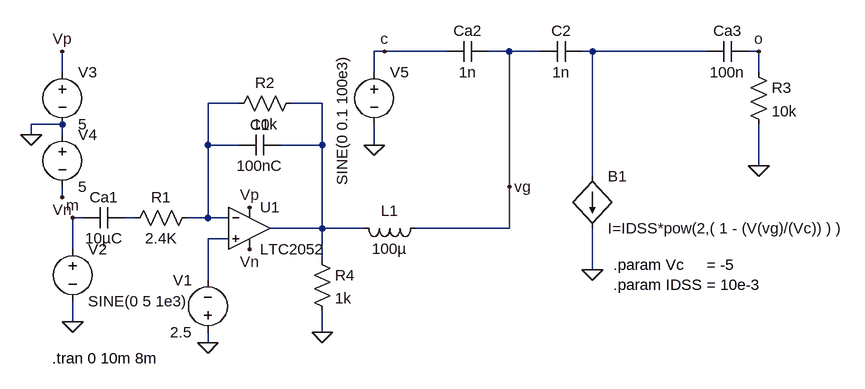
[diagram p0: schematic modFM.asc]
modFM.asc, the LTspice schematic file:
Version 4
SHEET 1 1244 680
WIRE 336 -32 320 -32
WIRE 432 -32 336 -32
WIRE 528 -32 496 -32
WIRE 576 -32 528 -32
WIRE 656 -32 640 -32
WIRE 832 -32 656 -32
WIRE 912 -32 896 -32
WIRE -160 0 -160 -32
WIRE 320 0 320 -32
WIRE 912 0 912 -32
WIRE 112 48 64 48
WIRE 240 48 192 48
WIRE -160 80 -208 80
WIRE -208 96 -208 80
WIRE -160 96 -160 80
WIRE 64 112 64 48
WIRE 112 112 64 112
WIRE 240 112 240 48
WIRE 240 112 176 112
WIRE 320 112 320 80
WIRE 912 144 912 80
WIRE 656 160 656 -32
WIRE 528 176 528 -32
WIRE -160 192 -160 176
WIRE -128 224 -144 224
WIRE -48 224 -64 224
WIRE 64 224 64 112
WIRE 64 224 32 224
WIRE 96 224 64 224
WIRE 240 240 240 112
WIRE 240 240 160 240
WIRE 304 240 240 240
WIRE 528 240 528 176
WIRE 528 240 384 240
WIRE 96 256 64 256
WIRE -144 272 -144 224
WIRE 240 288 240 240
WIRE 656 304 656 240
WIRE 64 320 64 256
WIRE -144 384 -144 352
WIRE 240 400 240 368
WIRE 64 416 64 400
FLAG 64 416 0
FLAG -144 384 0
FLAG -208 96 0
FLAG -160 -32 Vp
FLAG 128 208 Vp
FLAG -160 192 Vn
FLAG 128 272 Vn
FLAG 320 112 0
FLAG 656 304 0
FLAG 528 176 vg
FLAG 912 144 0
FLAG 240 400 0
FLAG 336 -32 c
FLAG -144 224 m
FLAG 912 -32 o
SYMBOL res 48 208 R90
WINDOW 0 0 56 VBottom 2
WINDOW 3 32 56 VTop 2
SYMATTR InstName R1
SYMATTR Value 2.4K
SYMBOL res 208 32 R90
WINDOW 0 0 56 VBottom 2
WINDOW 3 32 56 VTop 2
SYMATTR InstName R2
SYMATTR Value 10k
SYMBOL cap 176 96 R90
WINDOW 0 0 32 VBottom 2
WINDOW 3 32 32 VTop 2
SYMATTR InstName C1
SYMATTR Value 100nC
SYMBOL cap -64 208 R90
WINDOW 0 0 32 VBottom 2
WINDOW 3 32 32 VTop 2
SYMATTR InstName Ca1
SYMATTR Value 10µC
SYMBOL voltage 64 416 R180
WINDOW 0 24 96 Left 2
WINDOW 3 24 16 Left 2
WINDOW 123 0 0 Left 2
WINDOW 39 0 0 Left 2
SYMATTR InstName V1
SYMATTR Value 2.5
SYMBOL voltage -144 256 R0
WINDOW 123 0 0 Left 2
WINDOW 39 0 0 Left 2
SYMATTR InstName V2
SYMATTR Value SINE(0 5 1e3)
SYMBOL Opamps\\LTC2052 128 240 R0
SYMATTR InstName U1
SYMBOL voltage -160 -16 R0
WINDOW 123 0 0 Left 2
WINDOW 39 0 0 Left 2
SYMATTR InstName V3
SYMATTR Value 5
SYMBOL voltage -160 80 R0
WINDOW 123 0 0 Left 2
WINDOW 39 0 0 Left 2
SYMATTR InstName V4
SYMATTR Value 5
SYMBOL ind 400 224 R90
WINDOW 0 5 56 VBottom 2
WINDOW 3 32 56 VTop 2
SYMATTR InstName L1
SYMATTR Value 100µ
SYMBOL voltage 320 -16 R0
WINDOW 123 0 0 Left 2
WINDOW 39 0 0 Left 2
WINDOW 3 -49 190 VLeft 2
SYMATTR InstName V5
SYMATTR Value SINE(0 0.1 100e3)
SYMBOL cap 496 -48 R90
WINDOW 0 0 32 VBottom 2
WINDOW 3 32 32 VTop 2
SYMATTR InstName Ca2
SYMATTR Value 1n
SYMBOL cap 640 -48 R90
WINDOW 0 0 32 VBottom 2
WINDOW 3 32 32 VTop 2
SYMATTR InstName C2
SYMATTR Value 1n
SYMBOL bi 656 160 R0
SYMATTR InstName B1
SYMATTR Value I=IDSS*pow(2,( 1 - (V(vg)/(Vc)) ) )
SYMBOL res 896 -16 R0
SYMATTR InstName R3
SYMATTR Value 10k
SYMBOL cap 896 -48 R90
WINDOW 0 0 32 VBottom 2
WINDOW 3 32 32 VTop 2
SYMATTR InstName Ca3
SYMATTR Value 100n
SYMBOL res 224 272 R0
SYMATTR InstName R4
SYMATTR Value 1k
TEXT -176 440 Left 2 !.tran 0 10m 8m
TEXT 688 296 Left 2 !.param Vc     = -5\n.param IDSS = 10e-3

The netlist it stands for:
* modFM.asc
R1 N002 N004 2.4K
R2 N003 N002 10k
C1 N003 N002 100nC
Ca1 N004 m 10µC
V1 0 N005 2.5
V2 m 0 SINE(0 5 1e3)
* U1: LTC2052 (symbol Opamps\LTC2052 not available, pins judged from their places): In+=N005 In-=N002 V+=Vp V-=Vn OUT=N003
V3 Vp 0 5
V4 0 Vn 5
L1 vg N003 100µ
V5 c 0 SINE(0 0.1 100e3)
Ca2 vg c 1n
C2 N001 vg 1n
B1 N001 0 I=IDSS*pow(2,( 1 - (V(vg)/(Vc)) ) )
R3 o 0 10k
Ca3 o N001 100n
R4 N003 0 1k
.tran 0 10m 8m
.param Vc     = -5
.param IDSS = 10e-3
.backanno
.end